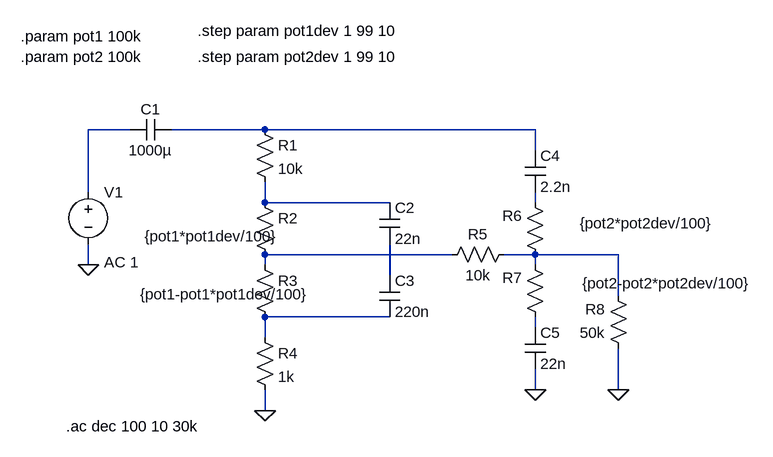
[diagram p0: schematic Draft1.asc]
Draft1.asc, the LTspice schematic file:
Version 4
SHEET 1 956 680
WIRE -16 80 -80 80
WIRE 192 80 48 80
WIRE 608 80 192 80
WIRE 608 112 608 80
WIRE -80 176 -80 80
WIRE 192 192 192 160
WIRE 384 192 192 192
WIRE 608 192 608 176
WIRE 480 272 192 272
WIRE 608 272 560 272
WIRE 736 272 608 272
WIRE -80 288 -80 256
WIRE 192 288 192 272
WIRE 608 288 608 272
WIRE 384 304 384 256
WIRE 736 336 736 272
WIRE 384 368 192 368
WIRE 608 384 608 368
WIRE 192 400 192 368
WIRE 608 480 608 448
WIRE 736 480 736 416
WIRE 192 512 192 480
FLAG 192 512 0
FLAG -80 288 0
FLAG 736 480 0
FLAG 608 480 0
SYMBOL voltage -80 160 R0
WINDOW 123 24 124 Left 2
WINDOW 39 0 0 Left 0
SYMATTR InstName V1
SYMATTR Value ""
SYMATTR Value2 AC 1
SYMBOL cap 48 64 R90
WINDOW 0 0 32 VBottom 2
WINDOW 3 32 32 VTop 2
SYMATTR InstName C1
SYMATTR Value 1000µ
SYMBOL res 176 64 R0
SYMATTR InstName R1
SYMATTR Value 10k
SYMBOL res 176 176 R0
WINDOW 3 -169 68 Left 2
SYMATTR InstName R2
SYMATTR Value {pot1*pot1dev/100}
SYMBOL res 176 272 R0
WINDOW 3 -176 61 Left 2
SYMATTR InstName R3
SYMATTR Value {pot1-pot1*pot1dev/100}
SYMBOL res 176 384 R0
SYMATTR InstName R4
SYMATTR Value 1k
SYMBOL cap 368 192 R0
SYMATTR InstName C2
SYMATTR Value 22n
SYMBOL cap 368 304 R0
SYMATTR InstName C3
SYMATTR Value 220n
SYMBOL res 576 256 R90
WINDOW 0 0 56 VBottom 2
WINDOW 3 32 56 VTop 2
SYMATTR InstName R5
SYMATTR Value 10k
SYMBOL res 624 288 R180
WINDOW 0 36 76 Left 2
WINDOW 3 -259 64 Left 2
SYMATTR InstName R6
SYMATTR Value {pot2*pot2dev/100}
SYMBOL res 624 384 R180
WINDOW 0 36 76 Left 2
WINDOW 3 -318 68 Left 2
SYMATTR InstName R7
SYMATTR Value {pot2-pot2*pot2dev/100}
SYMBOL res 752 432 R180
WINDOW 0 36 76 Left 2
WINDOW 3 36 40 Left 2
SYMATTR InstName R8
SYMATTR Value 50k
SYMBOL cap 592 112 R0
SYMATTR InstName C4
SYMATTR Value 2.2n
SYMBOL cap 592 384 R0
SYMATTR InstName C5
SYMATTR Value 22n
TEXT -184 -64 Left 2 !.param pot1 100k
TEXT -184 -32 Left 2 !.param pot2 100k
TEXT 88 -72 Left 2 !.step param pot1dev 1 99 10
TEXT 88 -32 Left 2 !.step param pot2dev 1 99 10
TEXT -114 536 Left 2 !.ac dec 100 10 30k

The netlist it stands for:
* Draft1.asc
V1 N001 0 AC 1
C1 N002 N001 1000µ
R1 N002 N003 10k
R2 N003 N005 {pot1*pot1dev/100}
R3 N005 N008 {pot1-pot1*pot1dev/100}
R4 N008 0 1k
C2 N003 N007 22n
C3 N007 N008 220n
R5 N006 N005 10k
R6 N006 N004 {pot2*pot2dev/100}
R7 N009 N006 {pot2-pot2*pot2dev/100}
R8 0 N006 50k
C4 N002 N004 2.2n
C5 N009 0 22n
.param pot1 100k
.param pot2 100k
.step param pot1dev 1 99 10
.step param pot2dev 1 99 10
.ac dec 100 10 30k
.backanno
.end